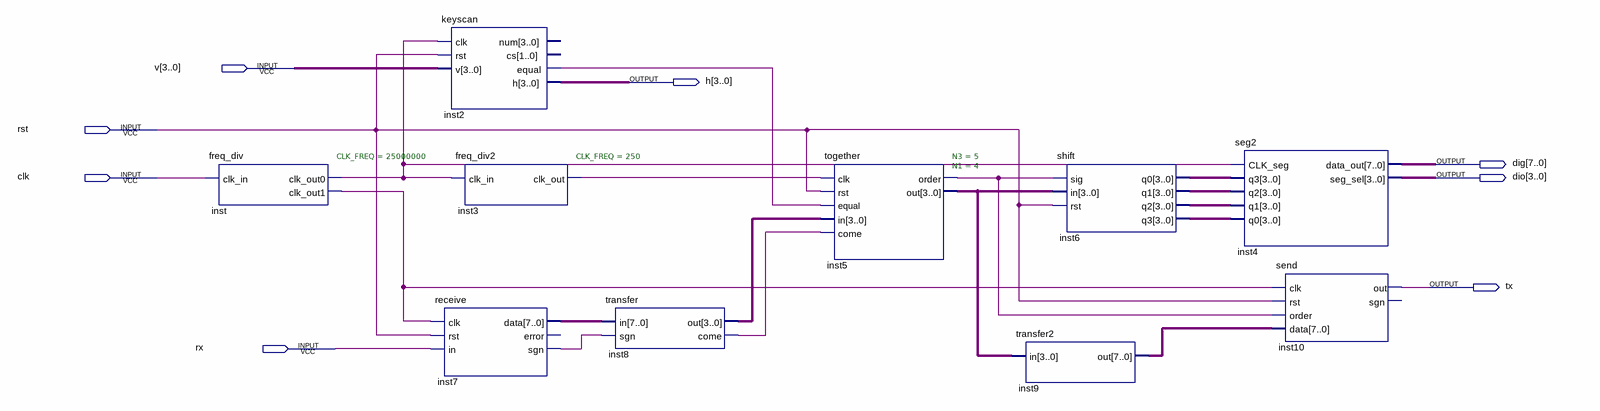
[diagram p0: schematic sheet]
// Quartus schematic unite.bdf as structural Verilog: 10 symbols, 8 pins
module unite (
  input  [3:0] v,
  input  rst,
  input  clk,
  input  rx,
  output [3:0] h,
  output [7:0] dig,
  output [3:0] dio,
  output tx
);

  wire inst2_equal, inst3_clk_out, inst5_order, inst7_sgn, inst8_come, inst_clk_out0, inst_clk_out1;
  wire [3:0] inst5_out, inst6_q0, inst6_q1, inst6_q2, inst6_q3, inst8_out;
  wire [7:0] inst7_data, inst9_out;

  freq_div #(.CLK_FREQ(25000000)) inst (.clk_in(clk), .clk_out0(inst_clk_out0), .clk_out1(inst_clk_out1));
  receive inst7 (.clk(inst_clk_out1), .rst(rst), .in(rx), .data(inst7_data), .sgn(inst7_sgn));  // open: error
  keyscan inst2 (.clk(inst_clk_out0), .rst(rst), .v(v), .equal(inst2_equal), .h(h));  // open: num, cs
  freq_div2 #(.CLK_FREQ(250)) inst3 (.clk_in(inst_clk_out0), .clk_out(inst3_clk_out));
  transfer inst8 (.in(inst7_data), .sgn(inst7_sgn), .out(inst8_out), .come(inst8_come));
  together #(.N3(5), .N1(4)) inst5 (
    .clk(inst3_clk_out), .rst(rst), .equal(inst2_equal), .in(inst8_out), .come(inst8_come),
    .order(inst5_order), .out(inst5_out));
  transfer2 inst9 (.in(inst5_out), .out(inst9_out));
  shift inst6 (
    .sig(inst5_order), .in(inst5_out), .rst(rst), .q0(inst6_q0), .q1(inst6_q1), .q2(inst6_q2), .q3(inst6_q3));
  seg2 inst4 (
    .CLK_seg(inst_clk_out0), .q3(inst6_q0), .q2(inst6_q1), .q1(inst6_q2), .q0(inst6_q3), .data_out(dig),
    .seg_sel(dio));
  send inst10 (.clk(inst_clk_out1), .rst(rst), .order(inst5_order), .data(inst9_out), .out(tx));  // open: sgn
endmodule
